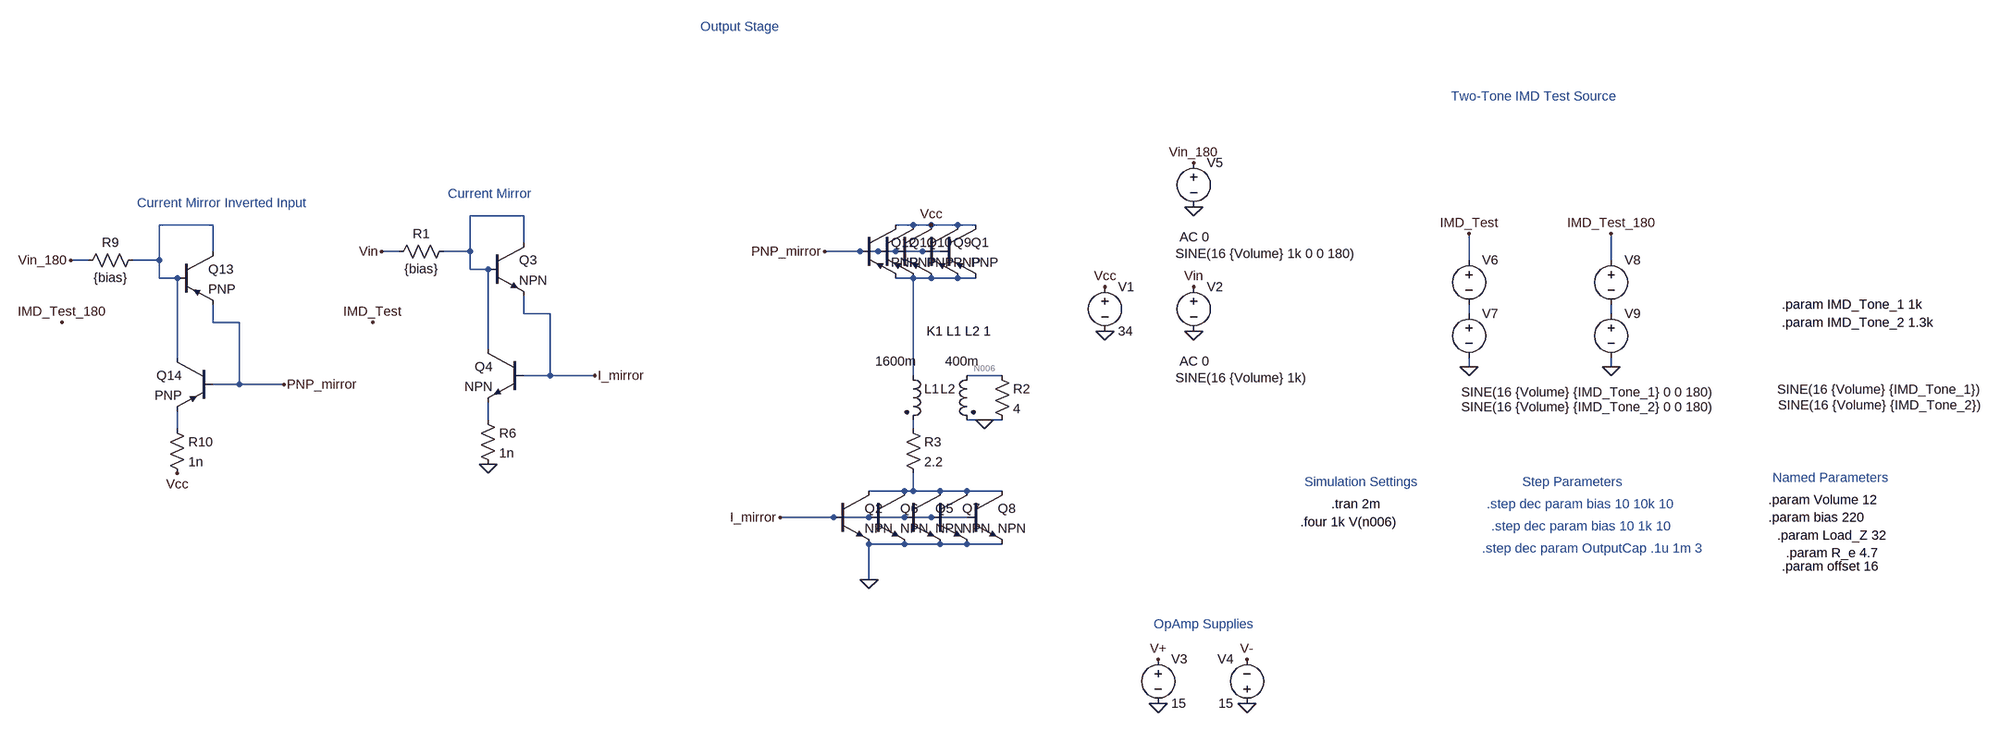
[diagram p0: schematic Current_mirror_amplifier_transformer.asc]
Current_mirror_amplifier_transformer.asc, the LTspice schematic file:
Version 4
SHEET 1 1600 680
WIRE -1904 -528 -2000 -528
WIRE -2464 -512 -2560 -512
WIRE -880 -512 -912 -512
WIRE -848 -512 -880 -512
WIRE -800 -512 -848 -512
WIRE -768 -512 -800 -512
WIRE -1904 -480 -1904 -528
WIRE -2464 -464 -2464 -512
WIRE -2128 -464 -2160 -464
WIRE -2000 -464 -2000 -528
WIRE -2000 -464 -2048 -464
WIRE -976 -464 -1040 -464
WIRE -944 -464 -976 -464
WIRE -912 -464 -944 -464
WIRE -864 -464 -912 -464
WIRE -832 -464 -864 -464
WIRE -2688 -448 -2720 -448
WIRE -2560 -448 -2560 -512
WIRE -2560 -448 -2608 -448
WIRE 576 -448 576 -496
WIRE 832 -448 832 -496
WIRE -2000 -432 -2000 -464
WIRE -1968 -432 -2000 -432
WIRE -2560 -416 -2560 -448
WIRE -2528 -416 -2560 -416
WIRE -880 -416 -912 -416
WIRE -848 -416 -880 -416
WIRE -800 -416 -848 -416
WIRE -768 -416 -800 -416
WIRE -1904 -352 -1904 -384
WIRE -1856 -352 -1904 -352
WIRE 576 -352 576 -368
WIRE 832 -352 832 -368
WIRE -2464 -336 -2464 -368
WIRE -2416 -336 -2464 -336
WIRE -1968 -288 -1968 -432
WIRE -2528 -272 -2528 -416
WIRE 576 -256 576 -272
WIRE 832 -256 832 -272
WIRE -1856 -240 -1856 -352
WIRE -1856 -240 -1904 -240
WIRE -1776 -240 -1856 -240
WIRE -880 -240 -880 -416
WIRE -720 -240 -784 -240
WIRE -2416 -224 -2416 -336
WIRE -2416 -224 -2464 -224
WIRE -2336 -224 -2416 -224
WIRE -1968 -160 -1968 -192
WIRE -752 -160 -784 -160
WIRE -720 -160 -752 -160
WIRE -2528 -144 -2528 -176
WIRE -880 -144 -880 -160
WIRE -896 -32 -960 -32
WIRE -880 -32 -880 -64
WIRE -880 -32 -896 -32
WIRE -832 -32 -880 -32
WIRE -784 -32 -832 -32
WIRE -720 -32 -784 -32
WIRE -1024 16 -1120 16
WIRE -960 16 -1024 16
WIRE -896 16 -960 16
WIRE -848 16 -896 16
WIRE -784 16 -848 16
WIRE -896 64 -960 64
WIRE -832 64 -896 64
WIRE -784 64 -832 64
WIRE -720 64 -784 64
WIRE -960 128 -960 64
FLAG -80 -400 Vcc
FLAG -80 -320 0
FLAG 80 -320 0
FLAG 80 -400 Vin
FLAG 176 352 0
FLAG 16 352 0
FLAG 16 272 V+
FLAG 176 272 V-
FLAG -960 128 0
FLAG -1968 -80 0
FLAG -1776 -240 I_mirror
FLAG -1120 16 I_mirror
FLAG -2336 -224 PNP_mirror
FLAG 80 -544 0
FLAG 80 -624 Vin_180
FLAG 576 -256 0
FLAG 832 -256 0
FLAG 576 -496 IMD_Test
FLAG 832 -496 IMD_Test_180
FLAG -2736 -336 IMD_Test_180
FLAG -2176 -336 IMD_Test
FLAG -2160 -464 Vin
FLAG -2720 -448 Vin_180
FLAG -2528 -64 Vcc
FLAG -848 -512 Vcc
FLAG -1040 -464 PNP_mirror
FLAG -752 -160 0
SYMBOL voltage -80 -416 R0
WINDOW 123 0 0 Left 2
WINDOW 39 0 0 Left 2
SYMATTR InstName V1
SYMATTR Value 34
SYMBOL voltage 80 -416 R0
WINDOW 3 -33 180 Left 2
WINDOW 123 -25 150 Left 2
WINDOW 39 24 124 Left 2
SYMATTR Value SINE(16 {Volume} 1k)
SYMATTR Value2 AC 0
SYMATTR InstName V2
SYMBOL voltage 16 256 R0
WINDOW 123 0 0 Left 2
WINDOW 39 0 0 Left 2
SYMATTR InstName V3
SYMATTR Value 15
SYMBOL voltage 176 368 R180
WINDOW 0 24 96 Left 2
WINDOW 3 24 16 Left 2
WINDOW 123 0 0 Left 2
WINDOW 39 0 0 Left 2
SYMATTR InstName V4
SYMATTR Value 15
SYMBOL npn -1024 -32 R0
SYMATTR InstName Q2
SYMBOL npn -1968 -480 R0
SYMATTR InstName Q3
SYMBOL npn -1904 -288 M0
SYMATTR InstName Q4
SYMBOL res -2144 -448 R270
WINDOW 0 32 56 VTop 2
WINDOW 3 0 56 VBottom 2
SYMATTR InstName R1
SYMATTR Value {bias}
SYMBOL npn -896 -32 R0
SYMATTR InstName Q5
SYMBOL res -1984 -176 R0
SYMATTR InstName R6
SYMATTR Value 1n
SYMBOL npn -960 -32 R0
SYMATTR InstName Q6
SYMBOL npn -848 -32 R0
SYMATTR InstName Q7
SYMBOL npn -784 -32 R0
SYMATTR InstName Q8
SYMBOL res -2704 -432 R270
WINDOW 0 32 56 VTop 2
WINDOW 3 0 56 VBottom 2
SYMATTR InstName R9
SYMATTR Value {bias}
SYMBOL res -2544 -160 R0
SYMATTR InstName R10
SYMATTR Value 1n
SYMBOL voltage 80 -640 R0
WINDOW 3 -33 180 Left 2
WINDOW 123 -25 150 Left 2
WINDOW 39 24 124 Left 2
SYMATTR Value SINE(16 {Volume} 1k 0 0 180)
SYMATTR Value2 AC 0
SYMATTR InstName V5
SYMBOL voltage 576 -464 R0
WINDOW 3 -14 254 Left 2
WINDOW 123 0 0 Left 2
WINDOW 39 0 0 Left 2
SYMATTR InstName V6
SYMATTR Value SINE(16 {Volume} {IMD_Tone_1} 0 0 180)
SYMBOL voltage 576 -368 R0
WINDOW 3 -14 185 Left 2
SYMATTR InstName V7
SYMATTR Value SINE(16 {Volume} {IMD_Tone_2} 0 0 180)
SYMBOL voltage 832 -464 R0
WINDOW 3 336 249 Left 2
SYMATTR InstName V8
SYMATTR Value SINE(16 {Volume} {IMD_Tone_1})
SYMBOL voltage 832 -368 R0
WINDOW 3 338 181 Left 2
SYMATTR InstName V9
SYMATTR Value SINE(16 {Volume} {IMD_Tone_2})
SYMBOL pnp -832 -512 R0
SYMATTR InstName Q1
SYMBOL pnp -864 -512 R0
SYMATTR InstName Q9
SYMBOL pnp -912 -512 R0
SYMATTR InstName Q10
SYMBOL pnp -944 -512 R0
SYMATTR InstName Q11
SYMBOL pnp -976 -512 R0
SYMATTR InstName Q12
SYMBOL pnp -2528 -464 R0
SYMATTR InstName Q13
SYMBOL pnp -2464 -272 M0
SYMATTR InstName Q14
SYMBOL ind2 -896 -256 R0
WINDOW 3 -53 -10 Left 2
SYMATTR InstName L1
SYMATTR Value 1600m
SYMATTR Type ind
SYMBOL ind2 -768 -256 M0
WINDOW 3 -6 -10 Left 2
SYMATTR InstName L2
SYMATTR Value 400m
SYMATTR Type ind
SYMBOL res -736 -256 R0
SYMATTR InstName R2
SYMATTR Value 4
SYMBOL res -896 -160 R0
SYMATTR InstName R3
SYMATTR Value 2.2
TEXT 328 -8 Left 2 !.tran 2m
TEXT 608 -8 Left 2 ;.step dec param bias 10 10k 10
TEXT 616 32 Left 2 ;.step dec param bias 10 1k 10
TEXT 600 72 Left 2 ;.step dec param OutputCap .1u 1m 3
TEXT 8 208 Left 2 ;OpAmp Supplies
TEXT -1264 -1112 Left 2 ;Output Stage
TEXT -2040 -568 Left 2 ;Current Mirror
TEXT 1152 -16 Left 2 !.param Volume 12
TEXT -2600 -552 Left 2 ;Current Mirror Inverted Input
TEXT 1152 16 Left 2 !.param bias 220
TEXT 1168 48 Left 2 !.param Load_Z 32
TEXT 1184 80 Left 2 !.param R_e 4.7
TEXT 544 -744 Left 2 ;Two-Tone IMD Test Source
TEXT 1176 -368 Left 2 !.param IMD_Tone_1 1k
TEXT 1176 -336 Left 2 !.param IMD_Tone_2 1.3k
TEXT 1160 -56 Left 2 ;Named Parameters
TEXT 672 -48 Left 2 ;Step Parameters
TEXT 280 -48 Left 2 ;Simulation Settings
TEXT 272 24 Left 2 !.four 1k V(n006)
TEXT 1176 104 Left 2 !.param offset 16
TEXT -856 -320 Left 2 !K1 L1 L2 1

The netlist it stands for:
* Current_mirror_amplifier_transformer.asc
V1 Vcc 0 34
V2 Vin 0 SINE(16 {Volume} 1k) AC 0
V3 V+ 0 15
V4 0 V- 15
Q2 N010 I_mirror 0 0 NPN
Q3 N001 N001 I_mirror 0 NPN
Q4 N001 I_mirror N007 0 NPN
R1 Vin N001 {bias}
Q5 N010 I_mirror 0 0 NPN
R6 N007 0 1n
Q6 N010 I_mirror 0 0 NPN
Q7 N010 I_mirror 0 0 NPN
Q8 N010 I_mirror 0 0 NPN
R9 Vin_180 N002 {bias}
R10 N008 Vcc 1n
V5 Vin_180 0 SINE(16 {Volume} 1k 0 0 180) AC 0
V6 IMD_Test N004 SINE(16 {Volume} {IMD_Tone_1} 0 0 180)
V7 N004 0 SINE(16 {Volume} {IMD_Tone_2} 0 0 180)
V8 IMD_Test_180 N005 SINE(16 {Volume} {IMD_Tone_1})
V9 N005 0 SINE(16 {Volume} {IMD_Tone_2})
Q1 Vcc PNP_mirror N003 0 PNP
Q9 Vcc PNP_mirror N003 0 PNP
Q10 Vcc PNP_mirror N003 0 PNP
Q11 Vcc PNP_mirror N003 0 PNP
Q12 Vcc PNP_mirror N003 0 PNP
Q13 N002 N002 PNP_mirror 0 PNP
Q14 N002 PNP_mirror N008 0 PNP
L1 N003 N009 1600m
L2 N006 0 400m
R2 N006 0 4
R3 N009 N010 2.2
.model NPN NPN
.model PNP PNP
.lib standard.bjt
.tran 2m
* .step dec param bias 10 10k 10
* .step dec param bias 10 1k 10
* .step dec param OutputCap .1u 1m 3
* OpAmp Supplies
* Output Stage
* Current Mirror
.param Volume 12
* Current Mirror Inverted Input
.param bias 220
.param Load_Z 32
.param R_e 4.7
* Two-Tone IMD Test Source
.param IMD_Tone_1 1k
.param IMD_Tone_2 1.3k
* Named Parameters
* Step Parameters
* Simulation Settings
.four 1k V(n006)
.param offset 16
K1 L1 L2 1
.backanno
.end